# Altium schematic sheet Sensor.SchDoc: Sensor
size A4; DocumentNumber: 1; Revision: 1; SheetNumber: 3; SheetTotal: 5
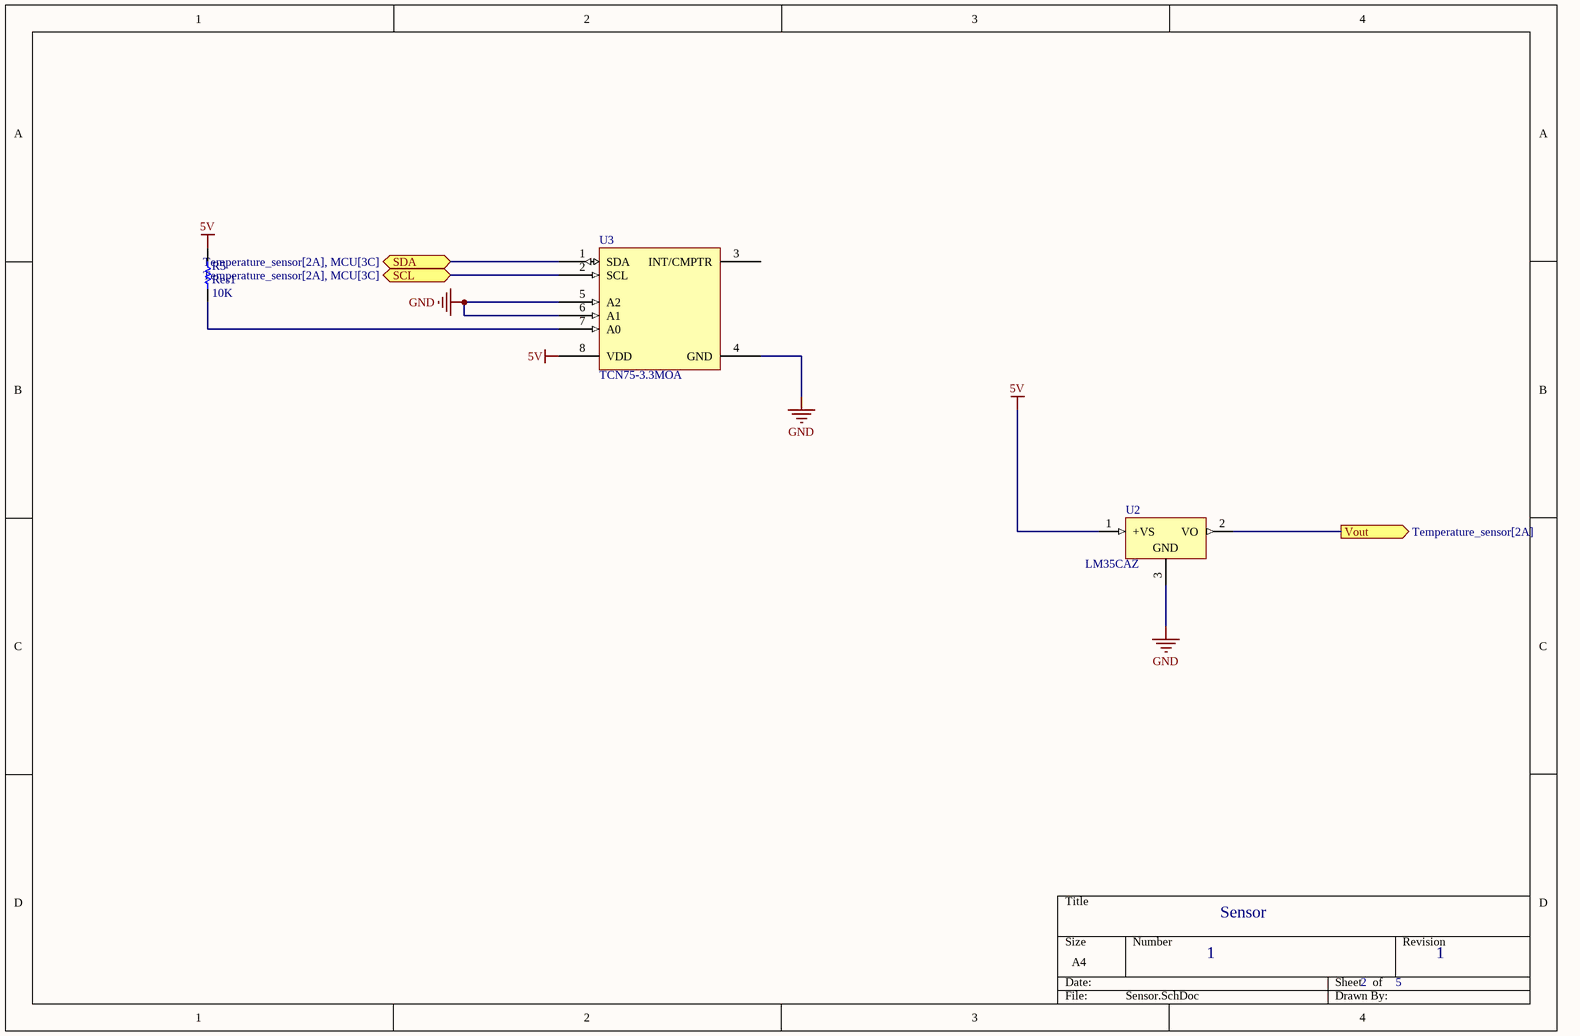
[diagram p0: Sensor.SchDoc]

## Parts
R5  Res1  value 10K  [0805]
U2  LM35CAZ  [Z03A]
U3  TCN75-3.3MOA  [SOIC127P600X175-8N]

## Ports
SCL (bidir, see Temperature_sensor[2A], MCU[3C]), SDA (bidir, see Temperature_sensor[2A], MCU[3C]), Vout (out, see Temperature_sensor[2A])

## Nets
5V: R5.2 U2.1(+VS) U3.8(VDD)
GND: U2.3(GND) U3.4(GND) U3.5(A2) U3.6(A1)
SCL: U3.2(SCL) ; port SCL
SDA: U3.1(SDA) ; port SDA
Vout: U2.2(VO) ; port Vout
NetR5_1: R5.1 U3.7(A0)

Not connected (* = marked no-connect by the designer): U3 3(INT/CMPTR)

## Notes on the sheet
- Sensor
- 1
- 2
- 5

## Library data of the parts
R5 = Res1: Resistor; Published: 8-Jun-2000; LatestRevisionDate: 17-Jul-2002; LatestRevisionNote: Re-released for DXP Platform.; PackageReference: AXIAL-0.3; Publisher: Altium Limited; PackageDescription: Axial Device, Thru-Hole; 2 Leads; 0.3 in Pin Spacing
U2 = LM35CAZ: Precision Centigrade Temperature Sensor, 3-pin TO-92; Manufacturer: National Semiconductor; PackageTopMarking: NSXYTT*LM35*CAZ; PowerWise: N; CompType: Temp Sensor IC; Published: 4-Dec-2008; LatestRevisionDate: 15-Jul-2009; LatestRevisionNote: Sch pins 1 & 3 reversed.; DatasheetVersion: Nov-2000; PackageVersion: revG, Sep-2000; PackageReference: Z03A; Publisher: Altium Limited; PackageDescription: TO-92, Molded, 3 Lead; Supplier 1: Farnell; Supplier Part Number 1: 9494529; PartNumber: LM35CAZ; RoHS: N; PinCount: 3; Code_JEDEC: TO-226-AA; ComponentLink1Description: LM35 Datasheet; ComponentLink1URL: http://www.national.com/ds/LM/LM35.pdf; ComponentLink2Description: LM35 Web Page; ComponentLink2URL: http://www.national.com/pf/LM/LM35.html; ComponentLink3Description: Z03A Package Page; ComponentLink3URL: http://www.national.com/packaging/folders/z03a.html
U3 = TCN75